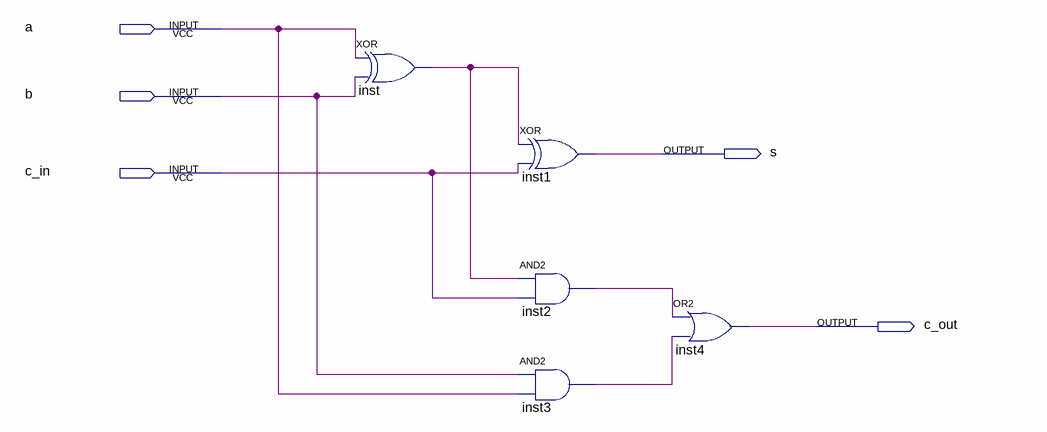
[diagram p0: schematic sheet]
// Quartus schematic Full_Adder_1bit.bdf as structural Verilog: 5 symbols, 5 pins
module Full_Adder_1bit (
  input  a,
  input  b,
  input  c_in,
  output s,
  output c_out
);

  wire inst2_out, inst3_out, inst_out;

  xor inst (inst_out, a, b);
  xor inst1 (s, inst_out, c_in);
  and inst2 (inst2_out, inst_out, c_in);
  and inst3 (inst3_out, b, a);
  or inst4 (c_out, inst2_out, inst3_out);
endmodule
